# Altium project Convert_Board.PrjPcb
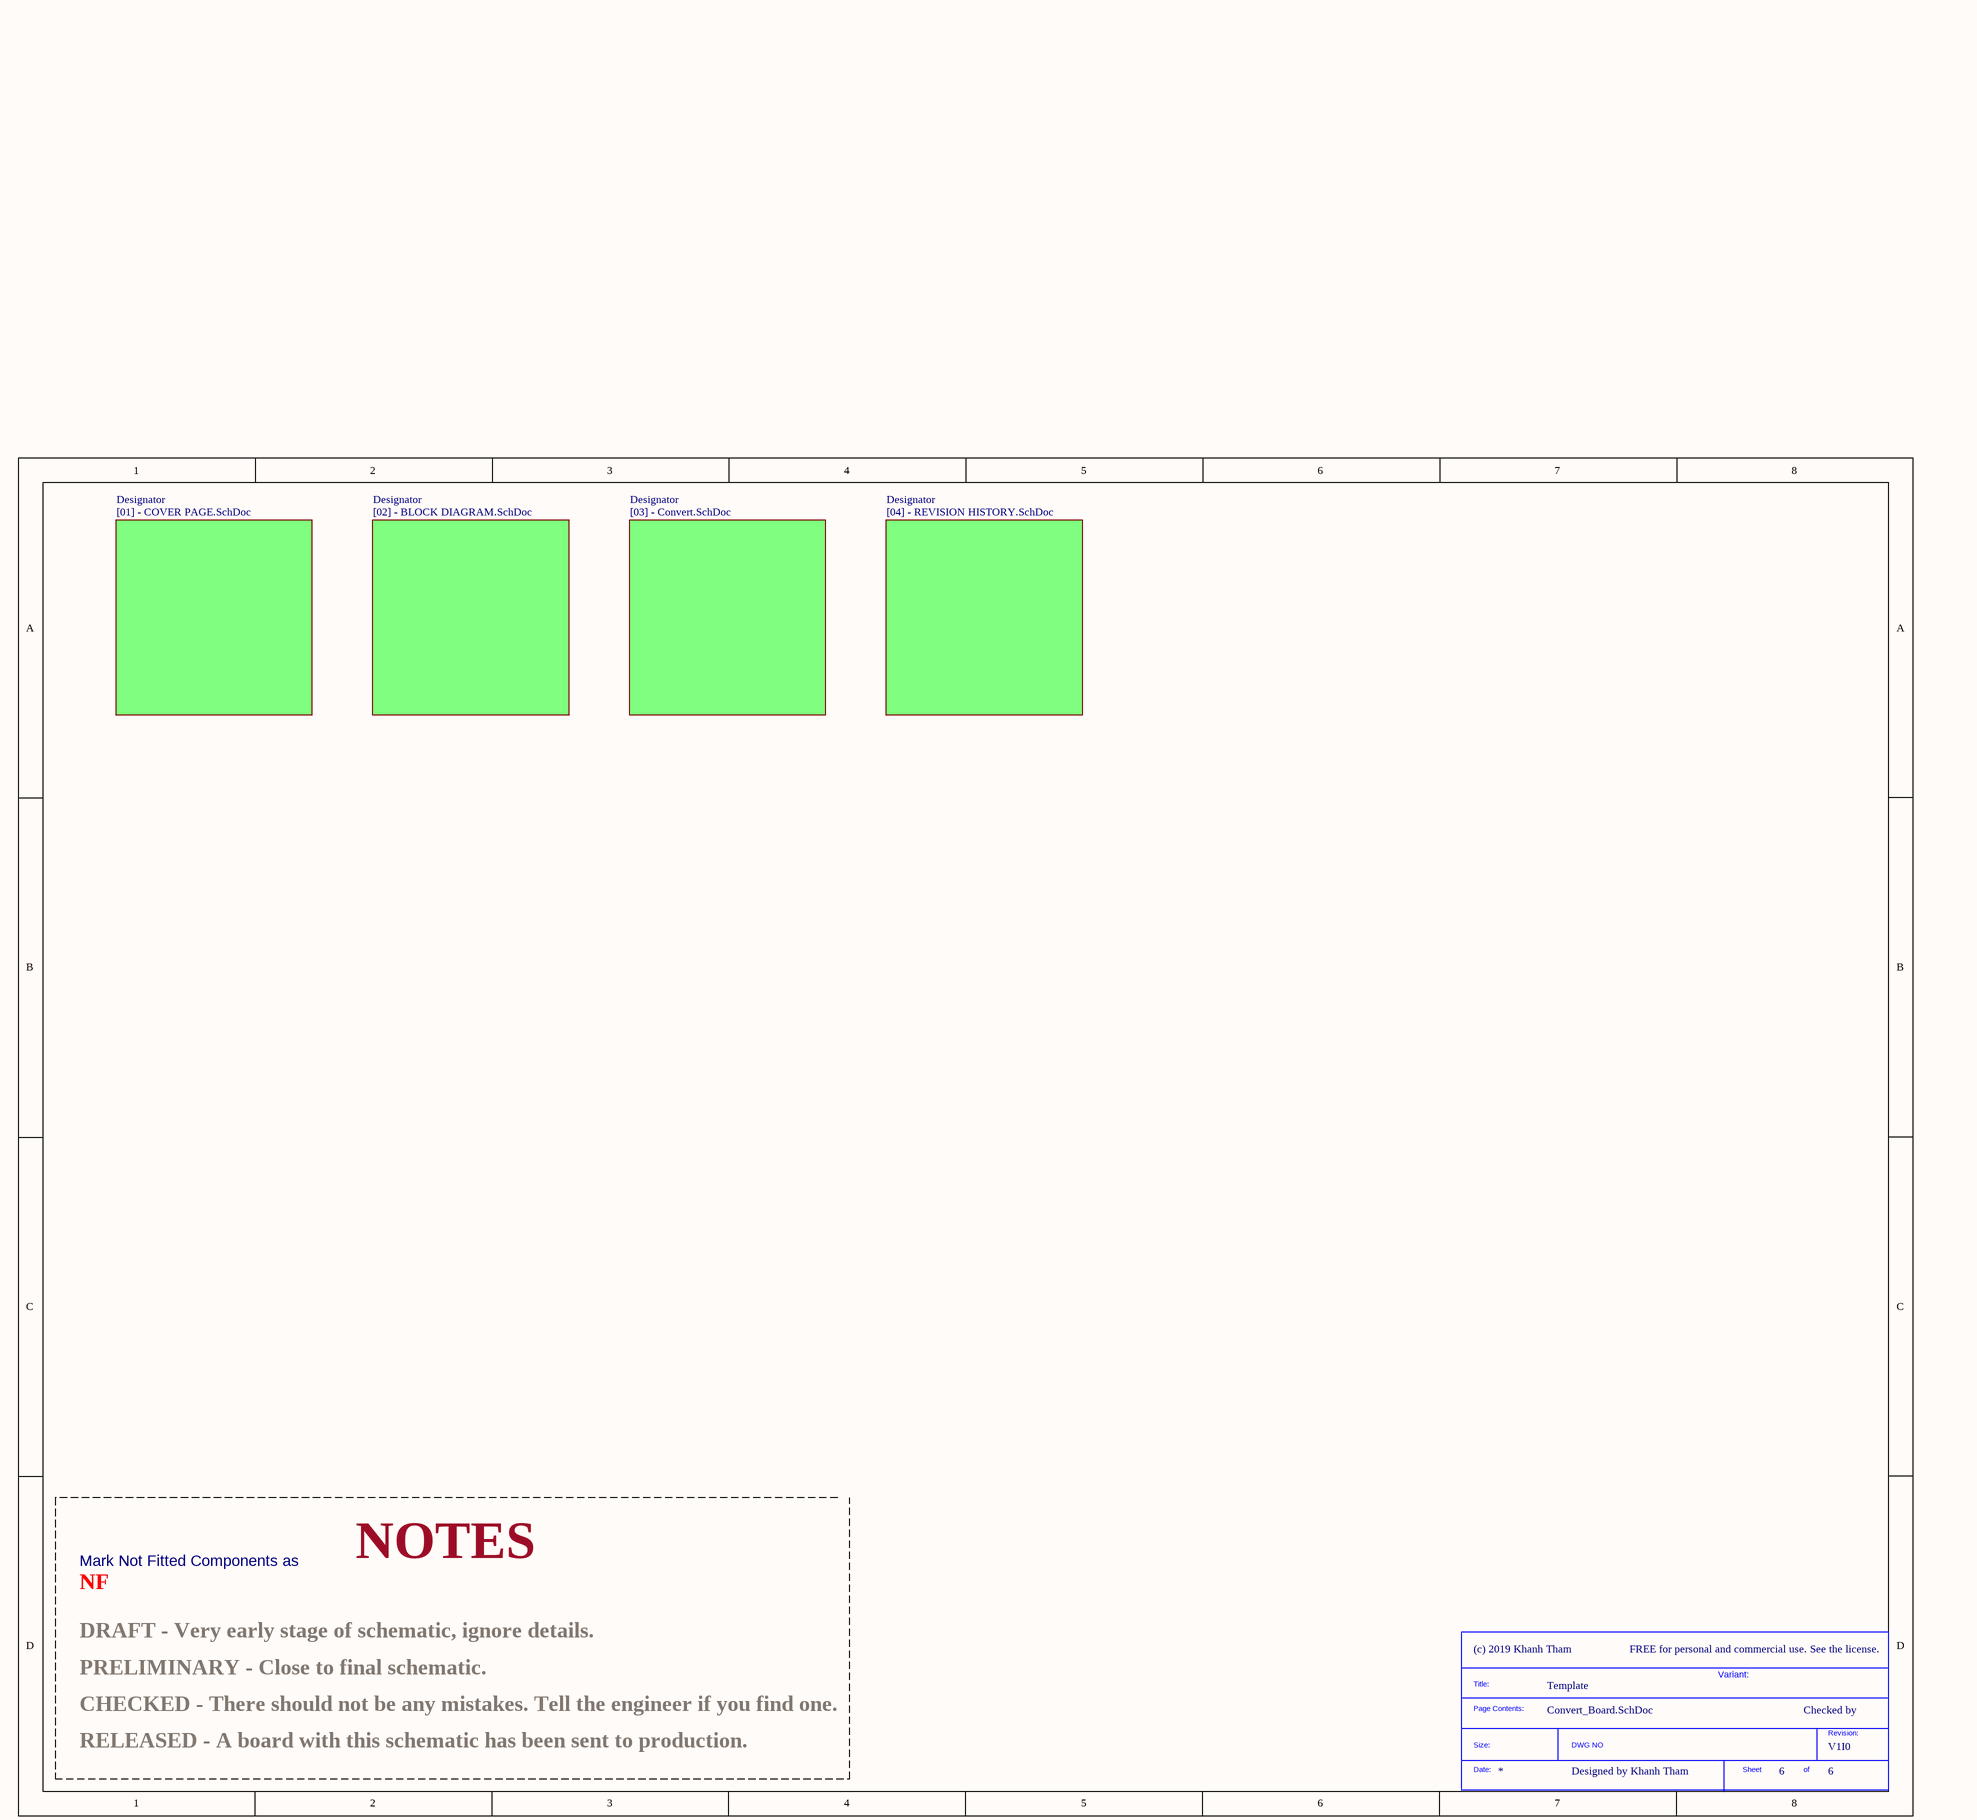
[diagram p0: Convert_Board.SchDoc]
ClientCompanyName: Kai; ClientContactEmail: thamkhanhdev@gmail.com; ClientContactName: Khanh Tham; ClientWebsite: N/A; Company: (c) 2019 Khanh Tham; NotFitted: NF; Project: Template; VersionRevision: V1I0
5 sheets, 21 parts. Net scope: flat (ports and power ports of the same name join across sheets).
Board file: Convert_Board.PcbDoc
Sheets:
  Convert_Board.SchDoc
    Designator = [01] - COVER PAGE.SchDoc
    Designator = [02] - BLOCK DIAGRAM.SchDoc
    Designator = [03] - Convert.SchDoc
    Designator = [04] - REVISION HISTORY.SchDoc

## Sheet Convert_Board.SchDoc
size A3; DocumentNumber: 6; SheetNumber: 6; SheetTotal: 6; PageSetup: Record=PageOptions|CenterHorizontal=True|CenterVertical=True|PrintScale=1.07|XCorrection=1.00|YCorrection=1.00|PrintKind=1|BorderSize=5000000|LeftOffset=0|BottomOffset=0|Orientation=2|PaperLength=1000|PaperWidth=1000|Scale=100|PaperSource=7|PrintQuality=600|MediaType=1|DitherType=10|PaperKind=A3|PrintScaleMode=1

### Parts
(Parts that share a designator on the sheet are numbered #1, #2 ... from top to bottom, then left to right.)
*#1  SDTitleBlock  (value not drawn)  (graphical)

### Sub-sheets
Designator = [01] - COVER PAGE.SchDoc: no entries
Designator = [02] - BLOCK DIAGRAM.SchDoc: no entries
Designator = [03] - Convert.SchDoc: no entries
Designator = [04] - REVISION HISTORY.SchDoc: no entries

### Notes on the sheet
- NF
- Mark Not Fitted Components as
- NOTES
- DRAFT - Very early stage of schematic, ignore details.
- FREE for personal and commercial use. See the license.
- PRELIMINARY - Close to final schematic.
- CHECKED - There should not be any mistakes. Tell the engineer if you find one.
- Variant:
- Checked by
- RELEASED - A board with this schematic has been sent to production.
- Designed by Khanh Tham
- (in symbol SDTitleBlock) Title:; Page Contents:; Revision:; Size:; DWG NO; Date:; Sheet; of

## Sheet [01] - COVER PAGE.SchDoc
size A3; DocumentNumber: 1; SheetNumber: 1; SheetTotal: 6
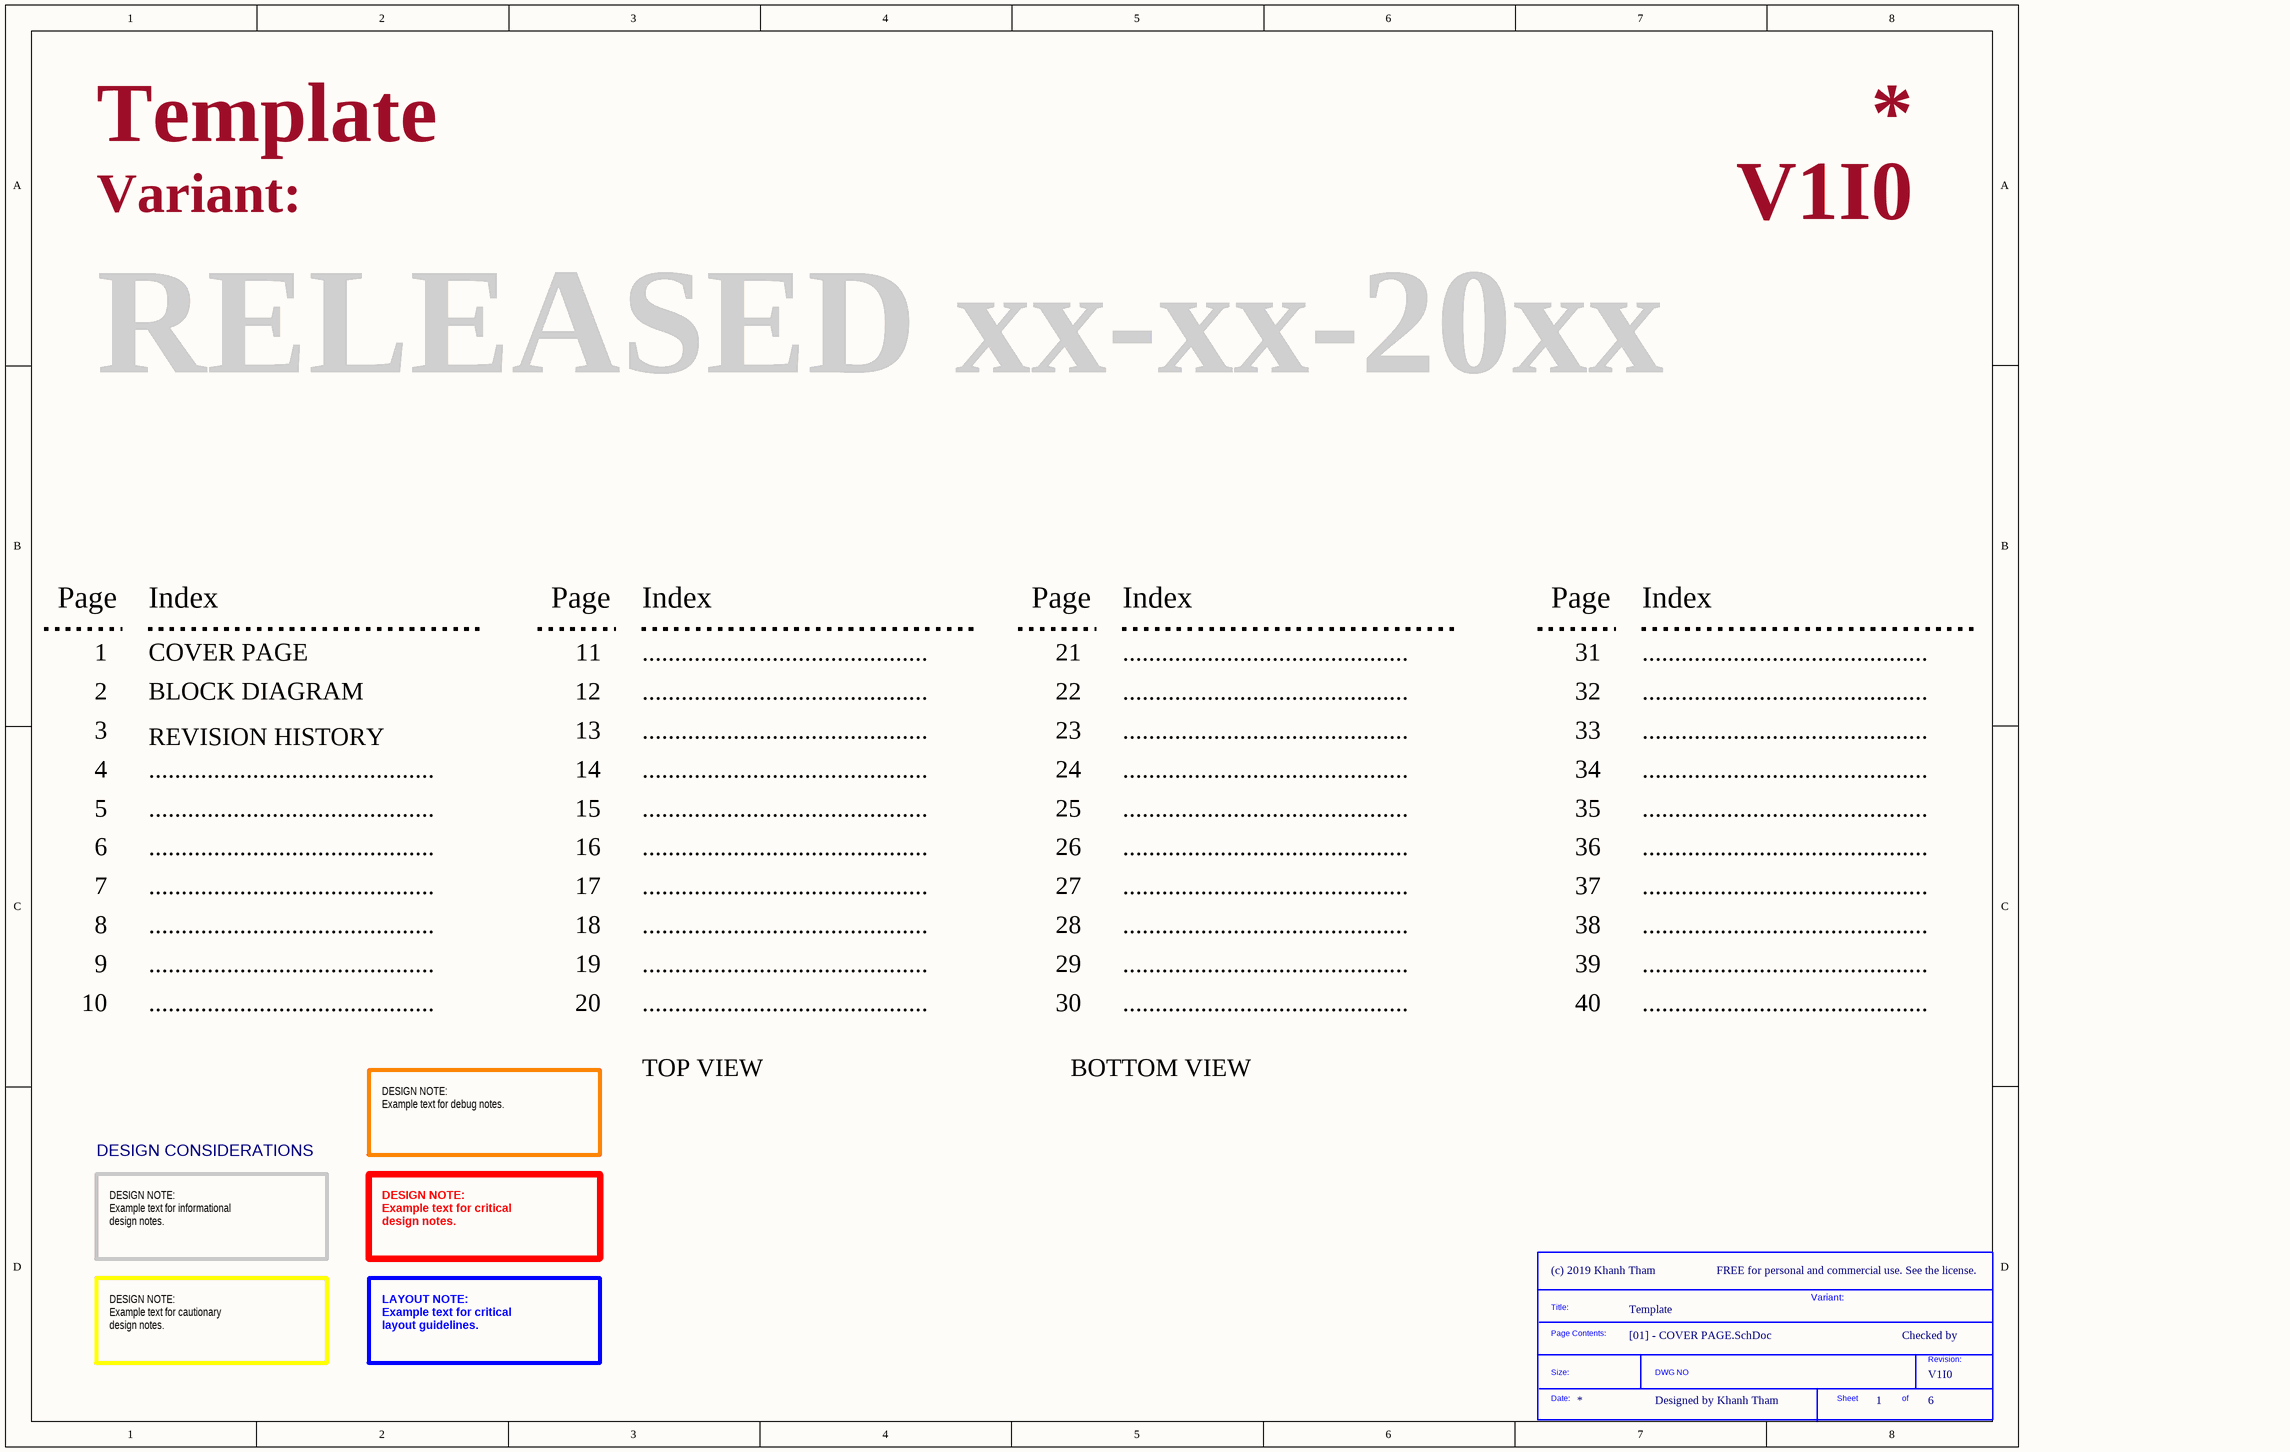
[diagram p1: [01] - COVER PAGE.SchDoc]

### Parts
(Parts that share a designator on the sheet are numbered #1, #2 ... from top to bottom, then left to right.)
*#2  SDTitleBlock  (value not drawn)  (graphical)

### Notes on the sheet
- Variant:
- RELEASED xx-xx-20xx
- Page
- Index
- 1
- COVER PAGE
- 11
- ............................................
- 21
- 31
- 2
- 3
- BLOCK DIAGRAM
- REVISION HISTORY
- 12
- 13
- 22
- 23
- 32
- 33
- 4
- 5
- 14
- 15
- 24
- 25
- 34
- 35
- 6
- 16
- 26
- 36
- 7
- 8
- 17
- 18
- 27
- 28
- 37
- 38
- 9
- 10
- 19
- 20
- 29
- 30
- 39
- 40
- TOP VIEW
- BOTTOM VIEW
- DESIGN NOTE:
  Example text for debug notes.
- DESIGN CONSIDERATIONS
- DESIGN NOTE:
  Example text for informational
  design notes.
- DESIGN NOTE:
  Example text for critical
  design notes.
- FREE for personal and commercial use. See the license.
- Checked by
- DESIGN NOTE:
  Example text for cautionary
  design notes.
- LAYOUT NOTE:
  Example text for critical
  layout guidelines.
- Designed by Khanh Tham
- (in symbol SDTitleBlock) Title:; Page Contents:; Revision:; Size:; DWG NO; Date:; Sheet; of

## Sheet [02] - BLOCK DIAGRAM.SchDoc
size A2; DocumentNumber: 2; SheetNumber: 2; SheetTotal: 6; PageSetup: Record=PageOptions|CenterHorizontal=True|CenterVertical=True|PrintScale=0.52|XCorrection=1.00|YCorrection=1.00|PrintKind=1|BorderSize=5000000|LeftOffset=0|BottomOffset=0|Orientation=2|PaperLength=1000|PaperWidth=1000|Scale=100|PaperSource=4|PrintQuality=600|MediaType=1|DitherType=10|PrintScaleMode=1|PaperKind=A4|PaperIndex=9
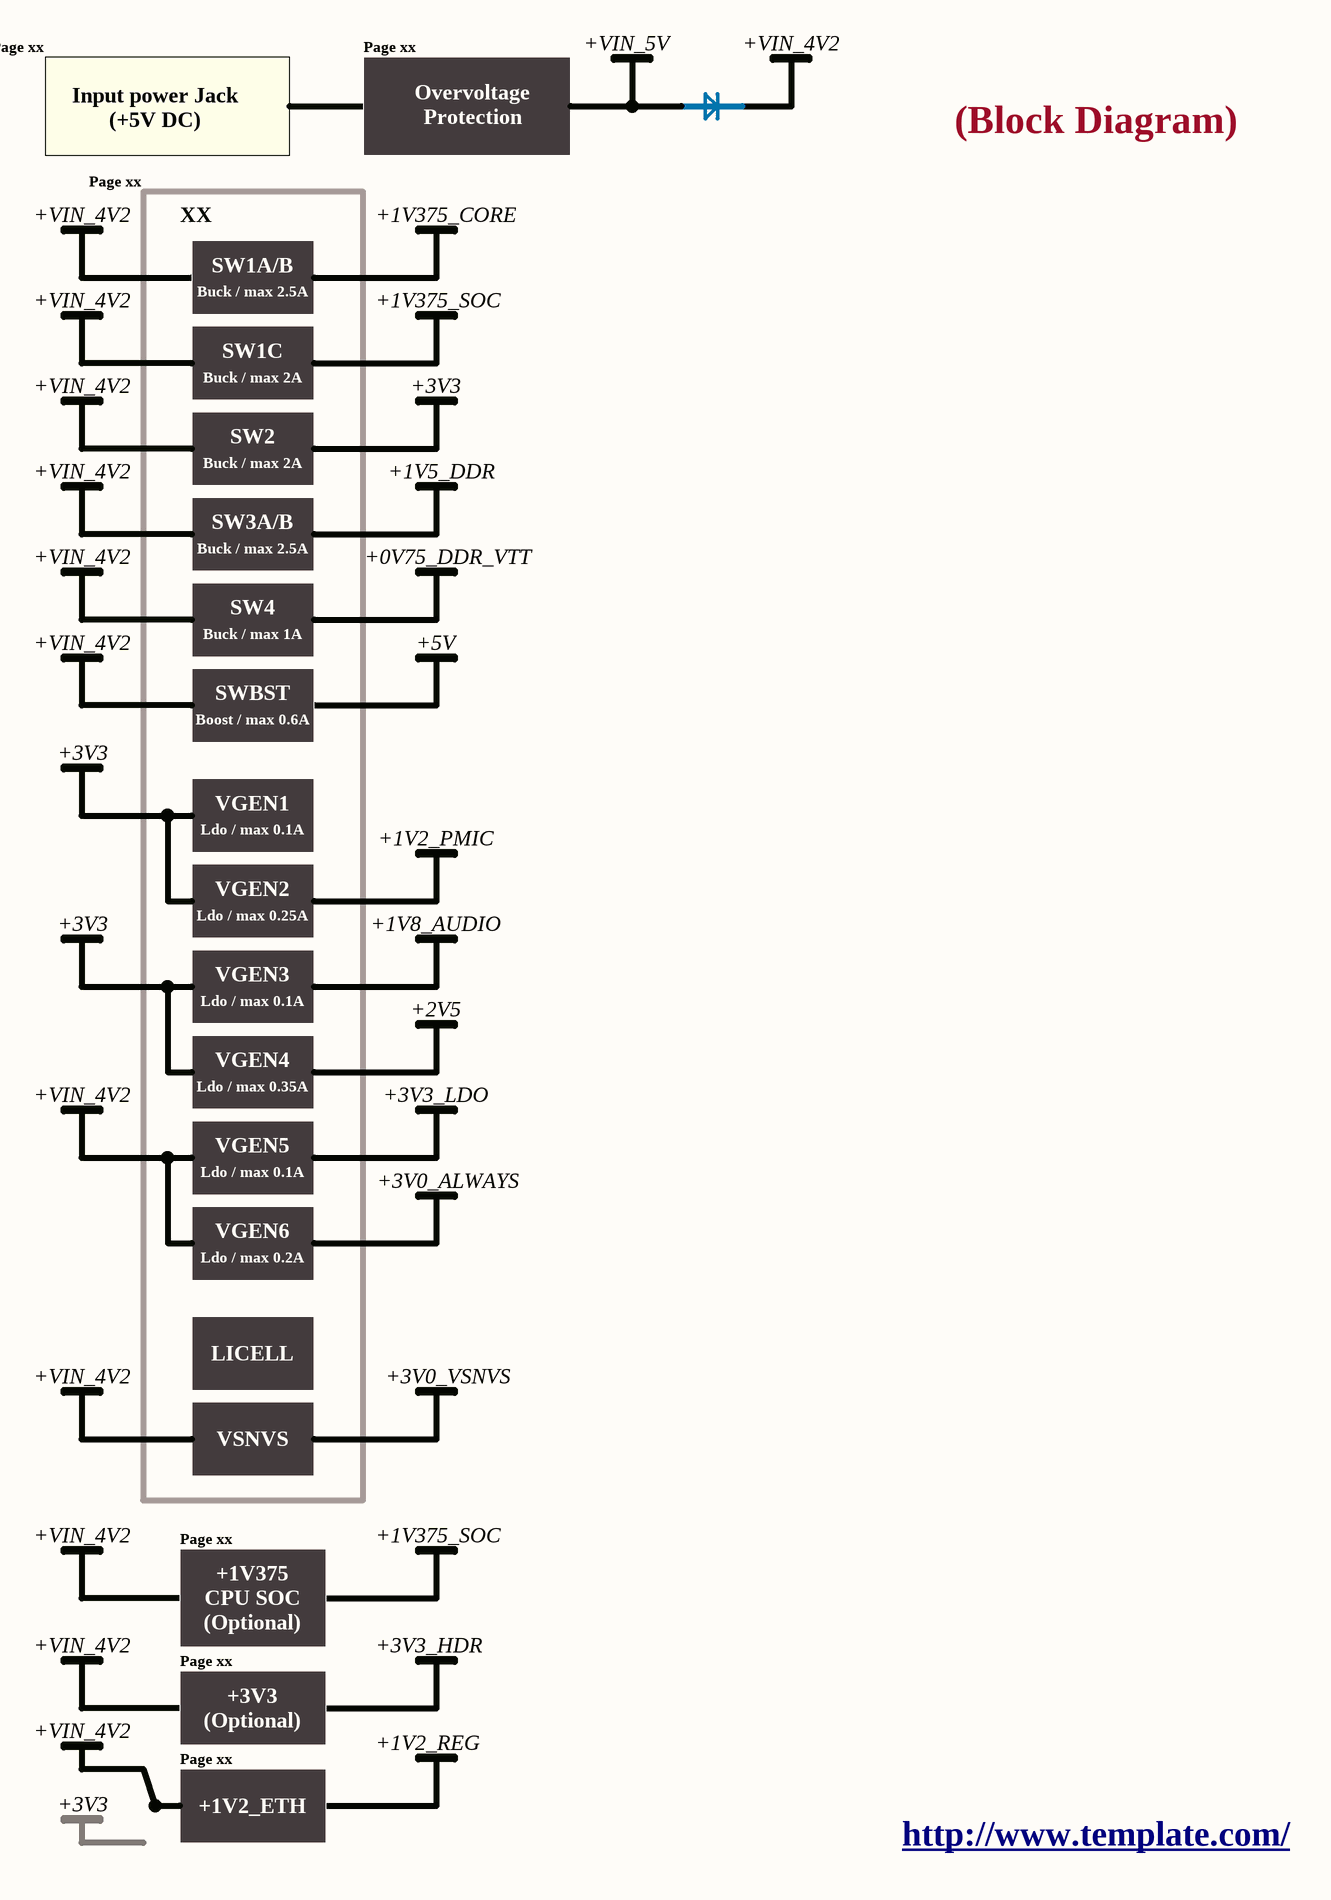
[diagram p2: [02] - BLOCK DIAGRAM.SchDoc, left]
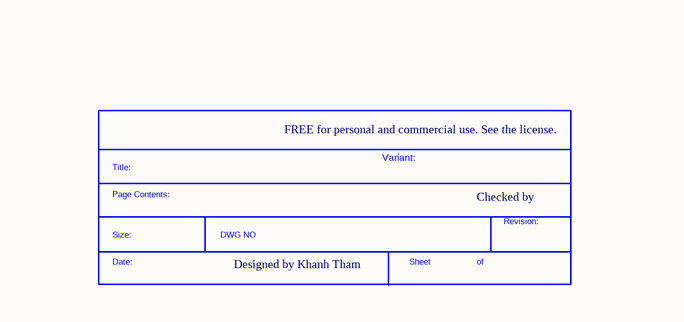
[diagram p3: [02] - BLOCK DIAGRAM.SchDoc, right]

### Parts
(Parts that share a designator on the sheet are numbered #1, #2 ... from top to bottom, then left to right.)
*#3  SDTitleBlock  (value not drawn)  (graphical)

### Notes on the sheet
- Page xx
- Input power Jack
- +VIN_5V
- +VIN_4V2
- (+5V DC)
- Overvoltage
- Protection
- (Block Diagram)
- XX
- SW1A/B
- +1V375_CORE
- Buck / max 2.5A
- +1V375_SOC
- SW1C
- Buck / max 2A
- +3V3
- SW2
- SW3A/B
- +1V5_DDR
- +0V75_DDR_VTT
- SW4
- Buck / max 1A
- SWBST
- +5V
- Boost / max 0.6A
- VGEN1
- Ldo / max 0.1A
- VGEN2
- +1V2_PMIC
- Ldo / max 0.25A
- +1V8_AUDIO
- VGEN3
- VGEN4
- +2V5
- Ldo / max 0.35A
- +3V3_LDO
- VGEN5
- +3V0_ALWAYS
- VGEN6
- Ldo / max 0.2A
- LICELL
- VSNVS
- +3V0_VSNVS
- +1V375
- CPU SOC
- (Optional)
- +3V3_HDR
- FREE for personal and commercial use. See the license.
- +1V2_ETH
- +1V2_REG
- Variant:
- Checked by
- http://www.template.com/
- Designed by Khanh Tham
- (in symbol SDTitleBlock) Title:; Page Contents:; Revision:; Size:; DWG NO; Date:; Sheet; of

## Sheet [03] - Convert.SchDoc
size A3
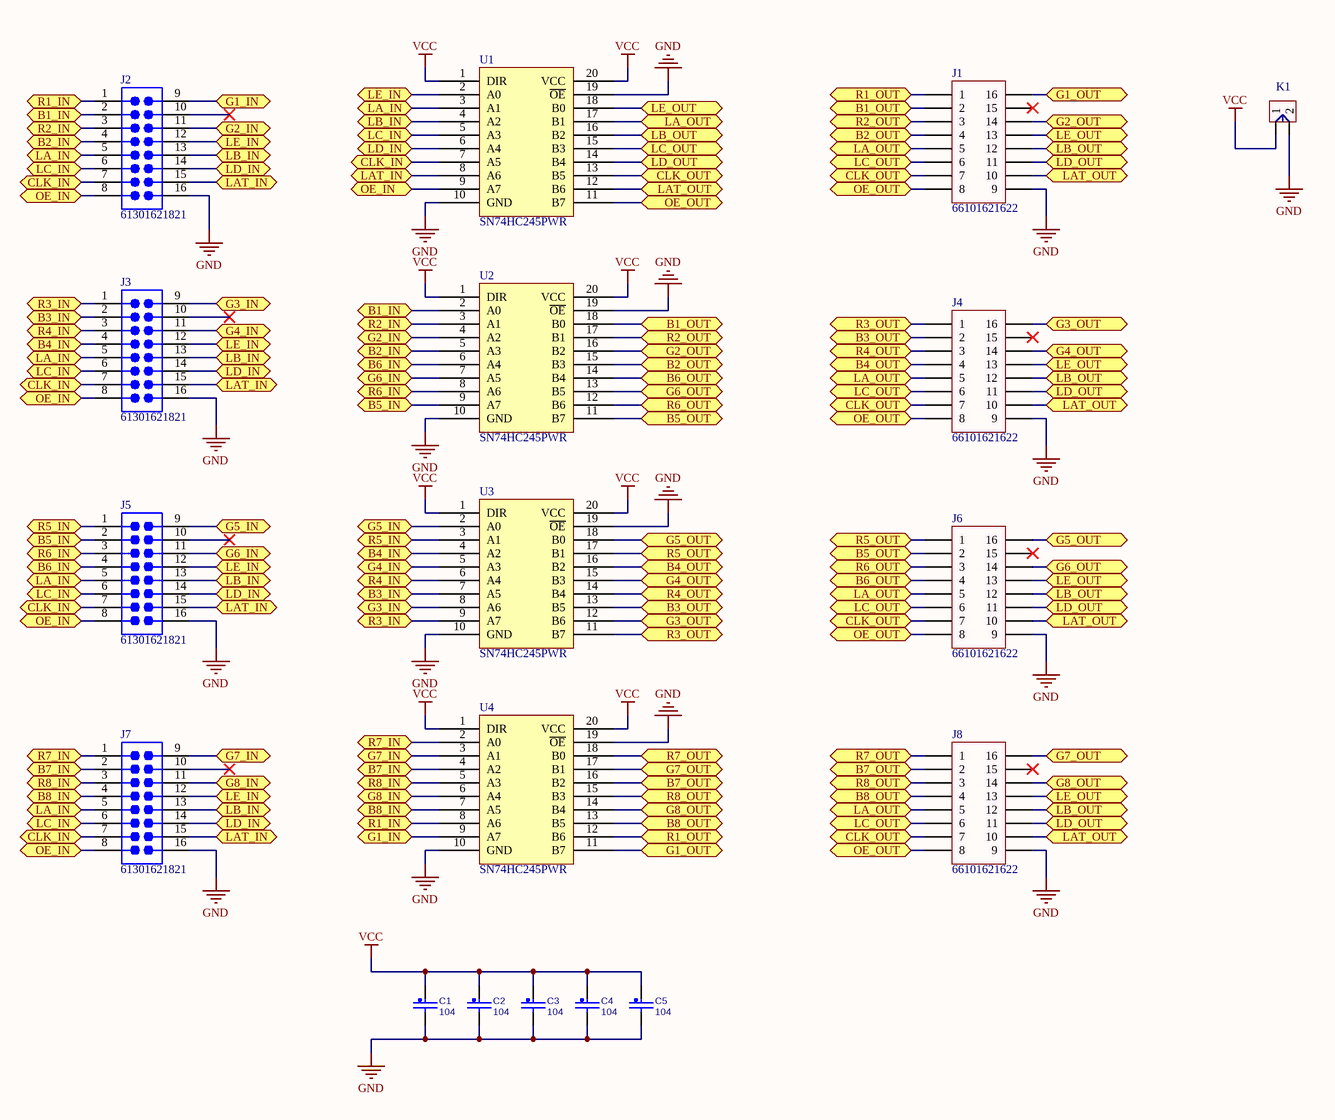
[diagram p4: [03] - Convert.SchDoc]

### Parts
C1  104  [C0805]
C2  104  [C0805]
C3  104  [C0805]
C4  104  [C0805]
C5  104  [C0805]
J1  66101621622  [66101621622]
J2  61301621821  [61301621821]
J3  61301621821  [61301621821]
J4  66101621622  [66101621622]
J5  61301621821  [61301621821]
J6  66101621622  [66101621622]
J7  61301621821  [61301621821]
J8  66101621622  [66101621622]
K1  KF2  [KF5.08 2DV]  (value not drawn)
U1  SN74HC245PWR  [TSSOP65P440X650-20N]
U2  SN74HC245PWR  [TSSOP65P440X650-20N]
U3  SN74HC245PWR  [TSSOP65P440X650-20N]
U4  SN74HC245PWR  [TSSOP65P440X650-20N]

### Ports
B1_IN (bidir), B1_OUT (bidir), B2_IN (bidir), B2_OUT (bidir), B3_IN (bidir), B3_OUT (bidir), B4_IN (bidir), B4_OUT (bidir), B5_IN (bidir), B5_OUT (bidir), B6_IN (bidir), B6_OUT (bidir), B7_IN (bidir), B7_OUT (bidir), B8_IN (bidir), B8_OUT (bidir), CLK_IN (bidir), CLK_OUT (bidir), G1_IN (bidir), G1_OUT (bidir), G2_IN (bidir), G2_OUT (bidir), G3_IN (bidir), G3_OUT (bidir), G4_IN (bidir), G4_OUT (bidir), G5_IN (bidir), G5_OUT (bidir), G6_IN (bidir), G6_OUT (bidir), G7_IN (bidir), G7_OUT (bidir), G8_IN (bidir), G8_OUT (bidir), LA_IN (bidir), LA_OUT (bidir), LAT_IN (bidir), LAT_OUT (bidir), LB_IN (bidir), LB_OUT (bidir), LC_IN (bidir), LC_OUT (bidir), LD_IN (bidir), LD_OUT (bidir), LE_IN (bidir), LE_OUT (bidir), OE_IN (bidir), OE_OUT (bidir), R1_IN (bidir), R1_OUT (bidir), R2_IN (bidir), R2_OUT (bidir), R3_IN (bidir), R3_OUT (bidir), R4_IN (bidir), R4_OUT (bidir), R5_IN (bidir), R5_OUT (bidir), R6_IN (bidir), R6_OUT (bidir), R7_IN (bidir), R7_OUT (bidir), R8_IN (bidir), R8_OUT (bidir)

### Nets
GND: C1.2 C2.2 C3.2 C4.2 C5.2 J1.9 J2.16 J3.16 J4.9 J5.16 J6.9 J7.16 J8.9 K1.2 U1.10(GND) U1.19(~{OE}) U2.10(GND) U2.19(~{OE}) U3.10(GND) U3.19(~{OE}) U4.10(GND) U4.19(~{OE})
VCC: C1.1 C2.1 C3.1 C4.1 C5.1 K1.1 U1.1(DIR) U1.20(VCC) U2.1(DIR) U2.20(VCC) U3.1(DIR) U3.20(VCC) U4.1(DIR) U4.20(VCC)
B1_IN: J2.2 U2.2(A0) ; port B1_IN
B1_OUT: J1.2 U2.18(B0) ; port B1_OUT
B2_IN: J2.4 U2.5(A3) ; port B2_IN
B2_OUT: J1.4 U2.15(B3) ; port B2_OUT
B3_IN: J3.2 U3.7(A5) ; port B3_IN
B3_OUT: J4.2 U3.13(B5) ; port B3_OUT
B4_IN: J3.4 U3.4(A2) ; port B4_IN
B4_OUT: J4.4 U3.16(B2) ; port B4_OUT
B5_IN: J5.2 U2.9(A7) ; port B5_IN
B5_OUT: J6.2 U2.11(B7) ; port B5_OUT
B6_IN: J5.4 U2.6(A4) ; port B6_IN
B6_OUT: J6.4 U2.14(B4) ; port B6_OUT
B7_IN: J7.2 U4.4(A2) ; port B7_IN
B7_OUT: J8.2 U4.16(B2) ; port B7_OUT
B8_IN: J7.4 U4.7(A5) ; port B8_IN
B8_OUT: J8.4 U4.13(B5) ; port B8_OUT
CLK_IN: J2.7 J3.7 J5.7 J7.7 U1.7(A5) ; port CLK_IN
CLK_OUT: J1.7 J4.7 J6.7 J8.7 U1.13(B5) ; port CLK_OUT
G1_IN: J2.9 U4.9(A7) ; port G1_IN
G1_OUT: J1.16 U4.11(B7) ; port G1_OUT
G2_IN: J2.11 U2.4(A2) ; port G2_IN
G2_OUT: J1.14 U2.16(B2) ; port G2_OUT
G3_IN: J3.9 U3.8(A6) ; port G3_IN
G3_OUT: J4.16 U3.12(B6) ; port G3_OUT
G4_IN: J3.11 U3.5(A3) ; port G4_IN
G4_OUT: J4.14 U3.15(B3) ; port G4_OUT
G5_IN: J5.9 U3.2(A0) ; port G5_IN
G5_OUT: J6.16 U3.18(B0) ; port G5_OUT
G6_IN: J5.11 U2.7(A5) ; port G6_IN
G6_OUT: J6.14 U2.13(B5) ; port G6_OUT
G7_IN: J7.9 U4.3(A1) ; port G7_IN
G7_OUT: J8.16 U4.17(B1) ; port G7_OUT
G8_IN: J7.11 U4.6(A4) ; port G8_IN
G8_OUT: J8.14 U4.14(B4) ; port G8_OUT
LA_IN: J2.5 J3.5 J5.5 J7.5 U1.3(A1) ; port LA_IN
LA_OUT: J1.5 J4.5 J6.5 J8.5 U1.17(B1) ; port LA_OUT
LAT_IN: J2.15 J3.15 J5.15 J7.15 U1.8(A6) ; port LAT_IN
LAT_OUT: J1.10 J4.10 J6.10 J8.10 U1.12(B6) ; port LAT_OUT
LB_IN: J2.13 J3.13 J5.13 J7.13 U1.4(A2) ; port LB_IN
LB_OUT: J1.12 J4.12 J6.12 J8.12 U1.16(B2) ; port LB_OUT
LC_IN: J2.6 J3.6 J5.6 J7.6 U1.5(A3) ; port LC_IN
LC_OUT: J1.6 J4.6 J6.6 J8.6 U1.15(B3) ; port LC_OUT
LD_IN: J2.14 J3.14 J5.14 J7.14 U1.6(A4) ; port LD_IN
LD_OUT: J1.11 J4.11 J6.11 J8.11 U1.14(B4) ; port LD_OUT
LE_IN: J2.12 J3.12 J5.12 J7.12 U1.2(A0) ; port LE_IN
LE_OUT: J1.13 J4.13 J6.13 J8.13 U1.18(B0) ; port LE_OUT
OE_IN: J2.8 J3.8 J5.8 J7.8 U1.9(A7) ; port OE_IN
OE_OUT: J1.8 J4.8 J6.8 J8.8 U1.11(B7) ; port OE_OUT
R1_IN: J2.1 U4.8(A6) ; port R1_IN
R1_OUT: J1.1 U4.12(B6) ; port R1_OUT
R2_IN: J2.3 U2.3(A1) ; port R2_IN
R2_OUT: J1.3 U2.17(B1) ; port R2_OUT
R3_IN: J3.1 U3.9(A7) ; port R3_IN
R3_OUT: J4.1 U3.11(B7) ; port R3_OUT
R4_IN: J3.3 U3.6(A4) ; port R4_IN
R4_OUT: J4.3 U3.14(B4) ; port R4_OUT
R5_IN: J5.1 U3.3(A1) ; port R5_IN
R5_OUT: J6.1 U3.17(B1) ; port R5_OUT
R6_IN: J5.3 U2.8(A6) ; port R6_IN
R6_OUT: J6.3 U2.12(B6) ; port R6_OUT
R7_IN: J7.1 U4.2(A0) ; port R7_IN
R7_OUT: J8.1 U4.18(B0) ; port R7_OUT
R8_IN: J7.3 U4.5(A3) ; port R8_IN
R8_OUT: J8.3 U4.15(B3) ; port R8_OUT

Not connected (* = marked no-connect by the designer): J1 15*; J2 10*; J3 10*; J4 15*; J5 10*; J6 15*; J7 10*; J8 15*

### Library data of the parts
C1-C5 = CAP-SMD-CERAMIC: Surface Mound Multilayer Ceramic Chip Capacitor (SMD MLCC); Manufacturer: TDK Corporation; Manufacturer Part Number: C2012X5R1C226K; Capacitance: 22pF; Voltage - Rated: 16V; Tolerance: ±10%; Temperature Coefficient: X5R; .Checked PCB: RF; RoHS: RoHS Compliant; Category: Capacitors; Mounting Type: Surface Mount, MLCC; Operating Temperature: -55°C ~ 85°C; Applications: General Purpose; Ratings: -; Package / Case: 0805 (2012 Metric); Size / Dimension: 0.079" L x 0.049" W (2.00mm x 1.25mm); Height - Seated (Max): -; Thickness (Max): 0.057" (1.45mm); Lead Spacing: -; Features: -; Packaging: Cut Tape (CT); Lead Style: -; ComponentLink1URL: http://www.tdk.com/pdf/general_B11.pdf; ComponentLink1Description: http://www.tdk.com/pdf/general_B11.pdf; .Checked SCH: RF
J1 J4 J6 J8 = LHeader 16 Dual 2.54MM: Manufacturer: Wurth Elektronik; ComponentLink1 Description: Manufacturer; ComponentLink2 Description: Datasheet; NoPins: 16; Created Date: March 2016; partNo: 66101621622; ComponentLink1URL: http://www.we-online.com; ComponentLink2URL: http://katalog.we-online.de/em/datasheet/6610XX11622.pdf; Created by: Baojun Chen
J2 J3 J5 J7 = JP8 2.54MM Dual Socket: 2.54 mm Dual Socket Header, 16p; PublishedDate: July 2016; Publisher: Wurth Elektronik; ComponentLink1Description: Manufacturer; ComponentLink1URL: http://www.we-online.de; ComponentLink2Description: Datasheet; ComponentLink2URL: http://katalog.we-online.de/em/datasheet/6130xx21821.pdf; PartNumber: 61301621821; PinNumber: 16p
K1 = KF2: KF2, 5.08mm, 10A, 300V, -40C ~ 105C
U1-U4 = SN74HC245PWR: IC Bus Transceiver 8 Bit 20TSSOP / Bus Xcvr Single 8-CH 3-ST 20-PIN TSSOP T/r; Manufacturer: Texas Instruments; Polarity: Non-Inverting; Direction: Bidirectional; Propagation Delay: 22ns; Number of Channels: 8; Min Supply Voltage: 2V; Max Supply Voltage: 6V; Number of Elements: 1; High Level Output Current: 7.8mA; Logic Function: Transceiver,Inverting; Turn-On Delay Time: 335ns; Operating Supply Voltage: 5V; Quiescent Current: 8uA; Output Type: 3-STATE; Manufacturer Part Number: SN74HC245PWR; RoHS: Yes; Category: Buffers, Drivers and Transceivers; Stock 1: 1091; Pricing 1: 1=0.58000, 10=0.50100, 25=0.46760, 100=0.37400, 250=0.34724, 500=0.29384, 1000=0.22705 (USD); Mount: Surface Mount; Case/Package: TSSOP; Number of Pins: 20; Weight: 0.002716oz; Contact Plating: Tin,Matte; Min Operating Temperature: -40°C; Max Operating Temperature: 85°C; Packaging: Tape and Reel; Package Quantity: 2000; Number of Bits per Element: 8; Low Level Output Current: 7.8mA; Number of Circuits: 8; Number of Bits: 8; Number of Outputs: 8; Series: 74HC; Technology: CMOS; Radiation Hardening: No; Lead Free: Lead Free; RoHS Compliant: Yes; REACH SVHC: No SVHC; ComponentLink1URL: https://datasheet.ciiva.com/15086/getdatasheetpartid-246702-15086434.pdf?src-supplier=Verical; ComponentLink1Description: https://datasheet.ciiva.com/15086/getdatasheetpartid-246702-15086434.pdf?src-supplier=Verical; ComponentLink2URL: https://datasheet.ciiva.com/41456/001016711-da-01-en-ic-bus-8bit-sn-sn74hc245pwr-tssop-20-tid-41456859.pdf?src-supplier=Conrad; ComponentLink2Description: https://datasheet.ciiva.com/41456/001016711-da-01-en-ic-bus-8bit-sn-sn74hc245pwr-tssop-20-tid-41456859.pdf?src-supplier=Conrad; ComponentLink3URL: https://datasheet.ciiva.com/46442/1836514-46442662.pdf?src-supplier=Element14; ComponentLink3Description: https://datasheet.ciiva.com/46442/1836514-46442662.pdf?src-supplier=Element14; ComponentLink4URL: https://datasheet.ciiva.com/14300/scls131d-14300551.pdf?src-supplier=Avnet; ComponentLink4Description: https://datasheet.ciiva.com/14300/scls131d-14300551.pdf?src-supplier=Avnet; ComponentLink5URL: https://datasheet.ciiva.com/46442/1836514-46442663.pdf?src-supplier=Element14; ComponentLink5Description: https://datasheet.ciiva.com/46442/1836514-46442663.pdf?src-supplier=Element14; ComponentLink6URL: https://datasheet.ciiva.com/1833/sn74hc245-1833928.pdf?src-supplier=Digi-Key; ComponentLink6Description: https://datasheet.ciiva.com/1833/sn74hc245-1833928.pdf?src-supplier=Digi-Key; ComponentLink7URL: https://datasheet.ciiva.com/1833/sn74hc245-1833929.pdf?src-supplier=Digi-Key; ComponentLink7Description: https://datasheet.ciiva.com/1833/sn74hc245-1833929.pdf?src-supplier=Digi-Key; ComponentLink8URL: https://datasheet.ciiva.com/1833/sn74hc245-1833930.pdf?src-supplier=Digi-Key; ComponentLink8Description: https://datasheet.ciiva.com/1833/sn74hc245-1833930.pdf?src-supplier=Digi-Key

## Sheet [04] - REVISION HISTORY.SchDoc
size A

## Assembly variants
Production: not fitted C177 C178 C179 C210 C237 C252 C263 C264 C327 C328 C390 C391 C392 C393 C406 C407 C408 C409 C410 C411 C416 C417 C418 C432 C433 D4 D8 D28 D29 D30 D31 D32 D36 D38 D39 FB2 FB8 FB17 FB20 FB26 FB29 FB32 FB35 FB38 FB41 FB42 FB43 L12 LINK1 LINK2 Q14 R15 R21 R24 R41 R52 R53 R54 R57 R58 R60 R65 R67 R68 R70 R87 R93 R104 R110 R114 R117 R119 R121 R123 R126 R128 R135 R138 R147 R148 R158 R159 R167 R168 R171 R174 R177 R178 R182 R191 R197 R199 R203 R207 R208 R209 R210 R211 R215 R216 R217 R234 R236 R239 R245 R250 R258 R261 R266 R271 R272 R274 R281 R282 R287 R290 R291 R294 R295 R298 R304 R310 R313 R316 R322 R325 R328 R331 R334 R335 R336 R337 R338 R339 R340 R341 R342 R343 R344 R347 R350 R352 R355 R357 R359 R360 R365 R367 R368 R371 R373 R374 R376 R378 R383 R385 R386 R387 R388 R392 R393 R394 R395 R396 R400 R401 R403 R408 R411 R412 R413 U17 U30 U34